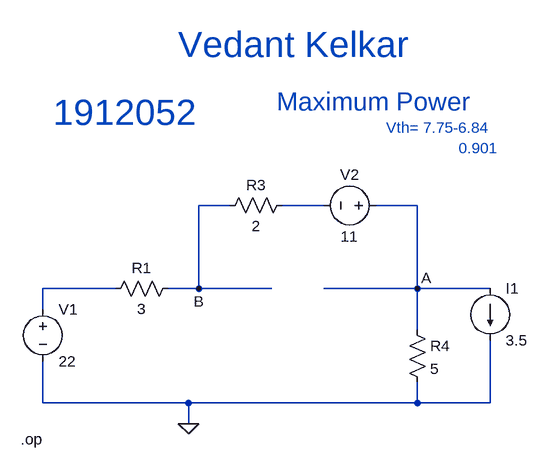
[diagram p0: schematic Draft3.asc]
Draft3.asc, the LTspice schematic file:
Version 4
SHEET 1 880 680
WIRE 224 0 176 0
WIRE 368 0 304 0
WIRE 512 0 448 0
WIRE 48 128 -64 128
WIRE 176 128 176 0
WIRE 176 128 128 128
WIRE 288 128 176 128
WIRE 512 128 512 0
WIRE 512 128 368 128
WIRE 624 128 512 128
WIRE -64 160 -64 128
WIRE 512 192 512 128
WIRE -64 304 -64 240
WIRE 160 304 -64 304
WIRE 512 304 512 272
WIRE 512 304 160 304
WIRE 624 304 624 208
WIRE 624 304 512 304
WIRE 160 336 160 304
FLAG 160 336 0
FLAG 512 128 A
FLAG 176 128 B
DATAFLAG 176 128 ""
DATAFLAG 512 128 ""
SYMBOL res 32 144 R270
WINDOW 0 32 56 VTop 2
WINDOW 3 0 56 VBottom 2
SYMATTR InstName R1
SYMATTR Value 3
SYMBOL res 208 16 R270
WINDOW 0 32 56 VTop 2
WINDOW 3 0 56 VBottom 2
SYMATTR InstName R3
SYMATTR Value 2
SYMBOL voltage -64 144 R0
WINDOW 123 0 0 Left 0
WINDOW 39 0 0 Left 0
SYMATTR InstName V1
SYMATTR Value 22
SYMBOL voltage 464 0 R90
WINDOW 0 -32 56 VBottom 2
WINDOW 3 32 56 VTop 2
WINDOW 123 0 0 Left 0
WINDOW 39 0 0 Left 0
SYMATTR InstName V2
SYMATTR Value 11
SYMBOL current 624 128 R0
WINDOW 123 0 0 Left 0
WINDOW 39 0 0 Left 0
SYMATTR InstName I1
SYMATTR Value 3.5
SYMBOL res 496 176 R0
SYMATTR InstName R4
SYMATTR Value 5
TEXT 144 -248 Left 5 ;Vedant Kelkar
TEXT -48 -144 Left 5 ;1912052
TEXT 296 -160 Left 4 ;Maximum Power
TEXT -98 360 Left 2 !.op
TEXT 576 -88 Left 2 ;0.901
TEXT 464 -120 Left 2 ;Vth= 7.75-6.84

The netlist it stands for:
* Draft3.asc
R1 N002 B 3
R3 B N001 2
V1 N002 0 22
V2 A N001 11
I1 A 0 3.5
R4 A 0 5
* Vedant Kelkar
* 1912052
* Maximum Power
.op
* 0.901
* Vth= 7.75-6.84
.backanno
.end